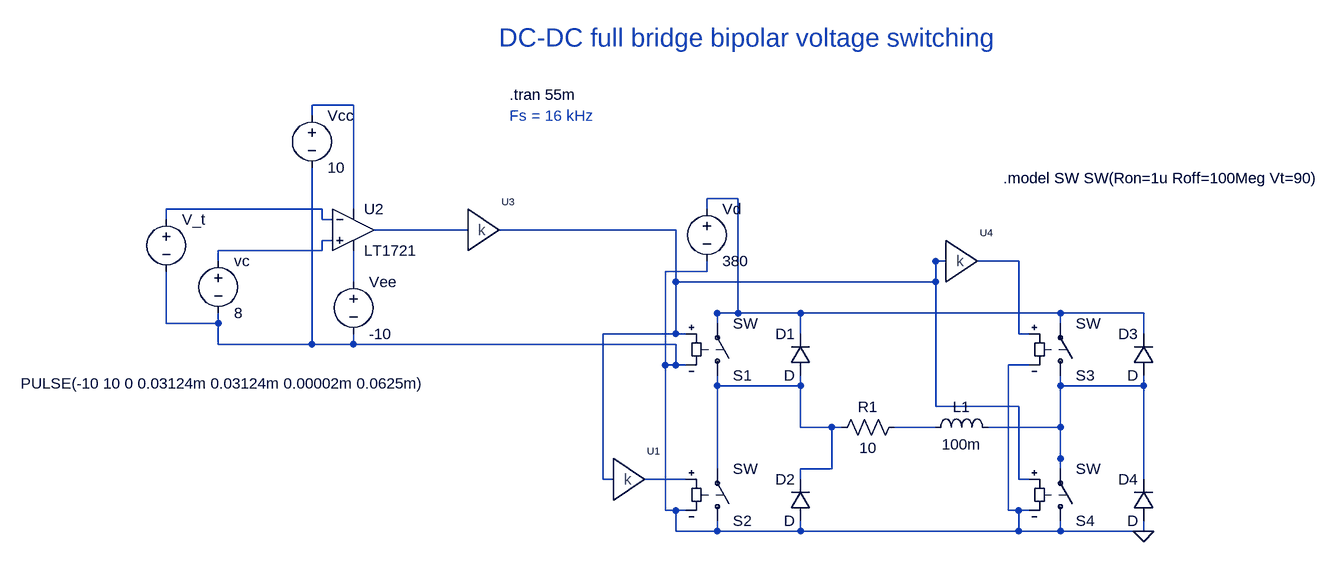
[diagram p0: schematic DCDC-full-bridge.asc]
DCDC-full-bridge.asc, the LTspice schematic file:
Version 4.1
SHEET 1 1180 680
WIRE 336 368 336 384
WIRE 864 368 864 384
WIRE 160 128 144 128
WIRE 208 368 208 384
WIRE 160 352 144 352
WIRE 688 128 672 128
WIRE 736 368 736 384
WIRE 688 352 672 352
WIRE -640 -16 -640 0
WIRE -416 -176 -416 -160
WIRE 192 -32 192 -16
WIRE -352 80 -352 96
WIRE -560 48 -560 64
WIRE 336 384 208 384
WIRE 208 384 144 384
WIRE 144 384 144 352
WIRE 144 352 128 352
WIRE 128 352 128 128
WIRE 128 128 144 128
WIRE 144 128 128 128
WIRE 128 128 128 -16
WIRE 128 -16 192 -16
WIRE 336 384 672 384
WIRE 672 384 672 352
WIRE 672 352 672 384
WIRE 672 384 736 384
WIRE 736 384 864 384
WIRE 672 352 656 352
WIRE 656 352 656 128
WIRE 656 128 672 128
WIRE 144 128 144 96
WIRE 144 96 -352 96
WIRE -352 96 -560 96
WIRE -560 96 -560 64
WIRE -560 64 -640 64
WIRE -640 64 -640 0
WIRE -352 96 -416 96
WIRE -416 96 -416 -160
FLAG 864 384 0
WIRE -352 -112 -352 -128
WIRE -416 -256 -416 -272
WIRE -352 -128 -352 -272
WIRE -352 -272 -416 -272
WIRE 160 80 144 80
WIRE 688 304 672 304
WIRE 48 304 32 304
WIRE -128 -80 -112 -80
WIRE 560 -32 544 -32
WIRE 144 80 32 80
WIRE 32 80 32 304
WIRE 144 80 144 -80
WIRE 144 -80 -112 -80
WIRE 144 80 144 0
WIRE 144 0 544 0
WIRE 544 0 544 -32
WIRE 544 -32 544 192
WIRE 544 192 672 192
WIRE 672 192 672 304
WIRE 336 80 336 64
WIRE 864 80 864 64
WIRE 208 64 208 48
WIRE 736 64 736 48
WIRE 192 -112 192 -128
WIRE 336 64 336 48
WIRE 336 48 208 48
WIRE 208 48 240 48
WIRE 240 48 240 -128
WIRE 240 -128 192 -128
WIRE 336 48 736 48
WIRE 736 48 864 48
WIRE 864 48 864 64
WIRE -384 -96 -400 -96
WIRE -640 -96 -640 -112
WIRE -400 -96 -400 -112
WIRE -400 -112 -640 -112
WIRE -320 -80 -304 -80
WIRE -176 -80 -192 -80
WIRE -304 -80 -192 -80
WIRE -384 -64 -400 -64
WIRE -560 -32 -560 -48
WIRE -400 -64 -400 -48
WIRE -400 -48 -560 -48
WIRE 688 80 672 80
WIRE 608 -32 624 -32
WIRE 672 80 672 -32
WIRE 672 -32 624 -32
WIRE -352 -48 -352 -32
WIRE -352 0 -352 -16
WIRE -352 -32 -352 -16
WIRE 336 144 336 160
WIRE 336 304 336 288
WIRE 400 224 384 224
WIRE 208 144 208 160
WIRE 208 288 208 272
WIRE 336 160 336 224
WIRE 336 224 384 224
WIRE 384 224 384 288
WIRE 384 288 336 288
WIRE 336 160 208 160
WIRE 208 160 208 272
WIRE 864 144 864 160
WIRE 864 304 864 288
WIRE 624 224 640 224
WIRE 736 144 736 160
WIRE 736 288 736 272
WIRE 864 160 736 160
WIRE 736 160 736 272
WIRE 864 160 864 288
WIRE 736 272 736 224
WIRE 736 224 640 224
WIRE 544 224 528 224
WIRE 480 224 496 224
WIRE 528 224 496 224
WIRE 160 304 144 304
WIRE 96 304 112 304
WIRE 144 304 112 304
SYMBOL Gain 64 304 R0
SYMATTR InstName U1
SYMBOL sw 208 160 M180
SYMATTR InstName S1
SYMBOL voltage 192 -128 R0
WINDOW 123 0 0 Left 0
WINDOW 39 0 0 Left 0
SYMATTR InstName Vd
SYMATTR Value 380
SYMBOL diode 352 144 R180
WINDOW 0 24 64 Left 2
WINDOW 3 24 0 Left 2
SYMATTR InstName D1
SYMBOL diode 352 368 R180
WINDOW 0 24 64 Left 2
WINDOW 3 24 0 Left 2
SYMATTR InstName D2
SYMBOL sw 208 384 M180
SYMATTR InstName S2
SYMBOL diode 880 144 R180
WINDOW 0 24 64 Left 2
WINDOW 3 24 0 Left 2
SYMATTR InstName D3
SYMBOL sw 736 160 M180
SYMATTR InstName S3
SYMBOL diode 880 368 R180
WINDOW 0 24 64 Left 2
WINDOW 3 24 0 Left 2
SYMATTR InstName D4
SYMBOL sw 736 384 M180
SYMATTR InstName S4
SYMBOL res 384 240 R270
WINDOW 0 32 56 VTop 2
WINDOW 3 0 56 VBottom 2
SYMATTR InstName R1
SYMATTR Value 10
SYMBOL ind 528 240 R270
WINDOW 0 32 56 VTop 2
WINDOW 3 5 56 VBottom 2
SYMATTR InstName L1
SYMATTR Value 100m
SYMBOL voltage -640 -112 R0
WINDOW 3 -224 268 Left 2
WINDOW 123 0 0 Left 0
WINDOW 39 0 0 Left 0
SYMATTR Value PULSE(-10 10 0 0.03124m 0.03124m 0.00002m 0.0625m)
SYMATTR InstName V_t
SYMBOL voltage -560 -48 R0
WINDOW 123 0 0 Left 0
WINDOW 39 0 0 Left 0
SYMATTR InstName vc
SYMATTR Value 8
SYMBOL Comparators\\LT1721 -352 -144 R0
SYMATTR InstName U2
SYMBOL voltage -416 -272 R0
WINDOW 123 0 0 Left 0
WINDOW 39 0 0 Left 0
SYMATTR InstName Vcc
SYMATTR Value 10
SYMBOL voltage -352 -16 R0
WINDOW 123 0 0 Left 0
WINDOW 39 0 0 Left 0
SYMATTR InstName Vee
SYMATTR Value -10
SYMBOL Gain -160 -80 R0
SYMATTR SpiceLine G=100
SYMATTR InstName U3
SYMBOL Gain 576 -32 R0
SYMATTR InstName U4
TEXT 648 -160 Left 2 !.model SW SW(Ron=1u Roff=100Meg Vt=90)
TEXT -112 -288 Left 2 !.tran 55m
TEXT -128 -376 Left 4 ;DC-DC full bridge bipolar voltage switching
TEXT -112 -256 Left 2 ;Fs = 16 kHz

The netlist it stands for:
* DCDC-full-bridge.asc
E§U1 N002 N012 G={G}
S1 N009 N003 N002 0 SW
Vd N003 0 380
D1 N009 N003 D
D2 0 N009 D
S2 0 N009 N012 0 SW
D3 N010 N003 D
S3 N010 N003 N007 0 SW
D4 0 N010 D
S4 0 N010 N002 0 SW
R1 N009 N011 10
L1 N011 N010 100m
V_t N004 0 PULSE(-10 10 0 0.03124m 0.03124m 0.00002m 0.0625m)
vc N006 0 8
X§U2 N006 N004 N001 N008 N005 LT1720  ; LT1721, pins In+ In- V+ V- OUT
Vcc N001 0 10
Vee N008 0 -10
E§U3 N005 N002 G={G} G=100
E§U4 N002 N007 G={G}
.model D D
.lib standard.dio
.model SW SW(Ron=1u Roff=100Meg Vt=90)
.tran 55m
* DC-DC full bridge bipolar voltage switching
* Fs = 16 kHz
.lib LTC.lib
.backanno
.end